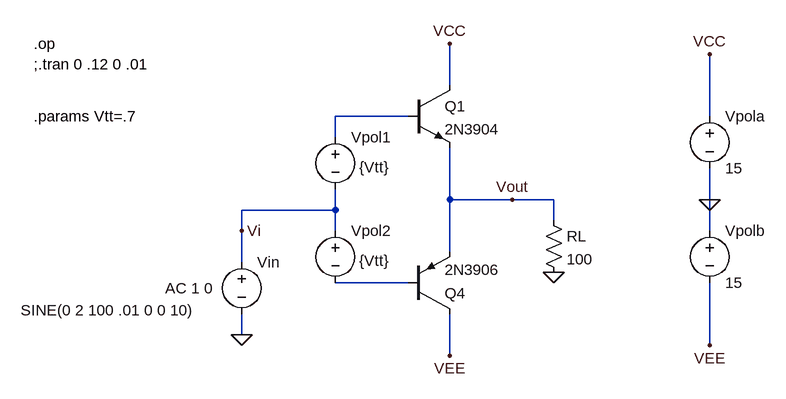
[diagram p0: schematic laboE2.asc]
laboE2.asc, the LTspice schematic file:
Version 4
SHEET 1 3532 2244
WIRE 400 80 400 16
WIRE 336 128 224 128
WIRE 800 128 800 32
WIRE 224 160 224 128
WIRE 400 256 400 176
WIRE 496 256 400 256
WIRE 560 256 496 256
WIRE 800 256 800 208
WIRE 224 272 224 240
WIRE 224 272 80 272
WIRE 560 288 560 256
WIRE 80 304 80 272
WIRE 224 304 224 272
WIRE 800 304 800 256
WIRE 400 336 400 256
WIRE 80 352 80 304
WIRE 336 384 224 384
WIRE 80 464 80 432
WIRE 800 480 800 384
WIRE 400 496 400 432
FLAG 800 32 VCC
FLAG 800 480 VEE
FLAG 800 256 0
FLAG 400 16 VCC
FLAG 400 496 VEE
FLAG 560 368 0
FLAG 80 304 Vi
FLAG 80 464 0
FLAG 496 256 Vout
SYMBOL voltage 80 336 R0
WINDOW 123 -118 56 Left 2
WINDOW 39 0 0 Left 0
WINDOW 3 -340 90 Left 2
SYMATTR Value2 AC 1 0
SYMATTR Value SINE(0 2 100 .01 0 0 10)
SYMATTR InstName Vin
SYMBOL voltage 800 112 R0
WINDOW 123 0 0 Left 0
WINDOW 39 0 0 Left 0
SYMATTR InstName Vpola
SYMATTR Value 15
SYMBOL voltage 800 288 R0
WINDOW 123 0 0 Left 0
WINDOW 39 0 0 Left 0
SYMATTR InstName Vpolb
SYMATTR Value 15
SYMBOL npn 336 80 R0
SYMATTR InstName Q1
SYMATTR Value 2N3904
SYMBOL res 544 272 R0
SYMATTR InstName RL
SYMATTR Value 100
SYMBOL pnp 336 432 M180
SYMATTR InstName Q4
SYMATTR Value 2N3906
SYMBOL voltage 224 144 R0
WINDOW 39 0 0 Left 0
WINDOW 3 37 62 Left 2
SYMATTR Value {Vtt}
SYMATTR Value2 AC 0 0
SYMATTR InstName Vpol1
SYMBOL voltage 224 288 R0
WINDOW 39 0 0 Left 0
WINDOW 3 37 62 Left 2
SYMATTR Value {Vtt}
SYMATTR Value2 AC 0 0
SYMATTR InstName Vpol2
TEXT -240 16 Left 2 !.op
TEXT -240 48 Left 2 !;.tran 0 .12 0 .01
TEXT -240 128 Left 2 !.params Vtt=.7

The netlist it stands for:
* laboE2.asc
Vin Vi 0 SINE(0 2 100 .01 0 0 10) AC 1 0
Vpola VCC 0 15
Vpolb 0 VEE 15
Q1 VCC N001 Vout 0 2N3904
RL Vout 0 100
Q4 VEE N002 Vout 0 2N3906
Vpol1 N001 Vi {Vtt} AC 0 0
Vpol2 Vi N002 {Vtt} AC 0 0
.model NPN NPN
.model PNP PNP
.lib standard.bjt
.op
;.tran 0 .12 0 .01
.params Vtt=.7
.backanno
.end